# EAGLE design MUL-6S (EAGLE 9.5.2)
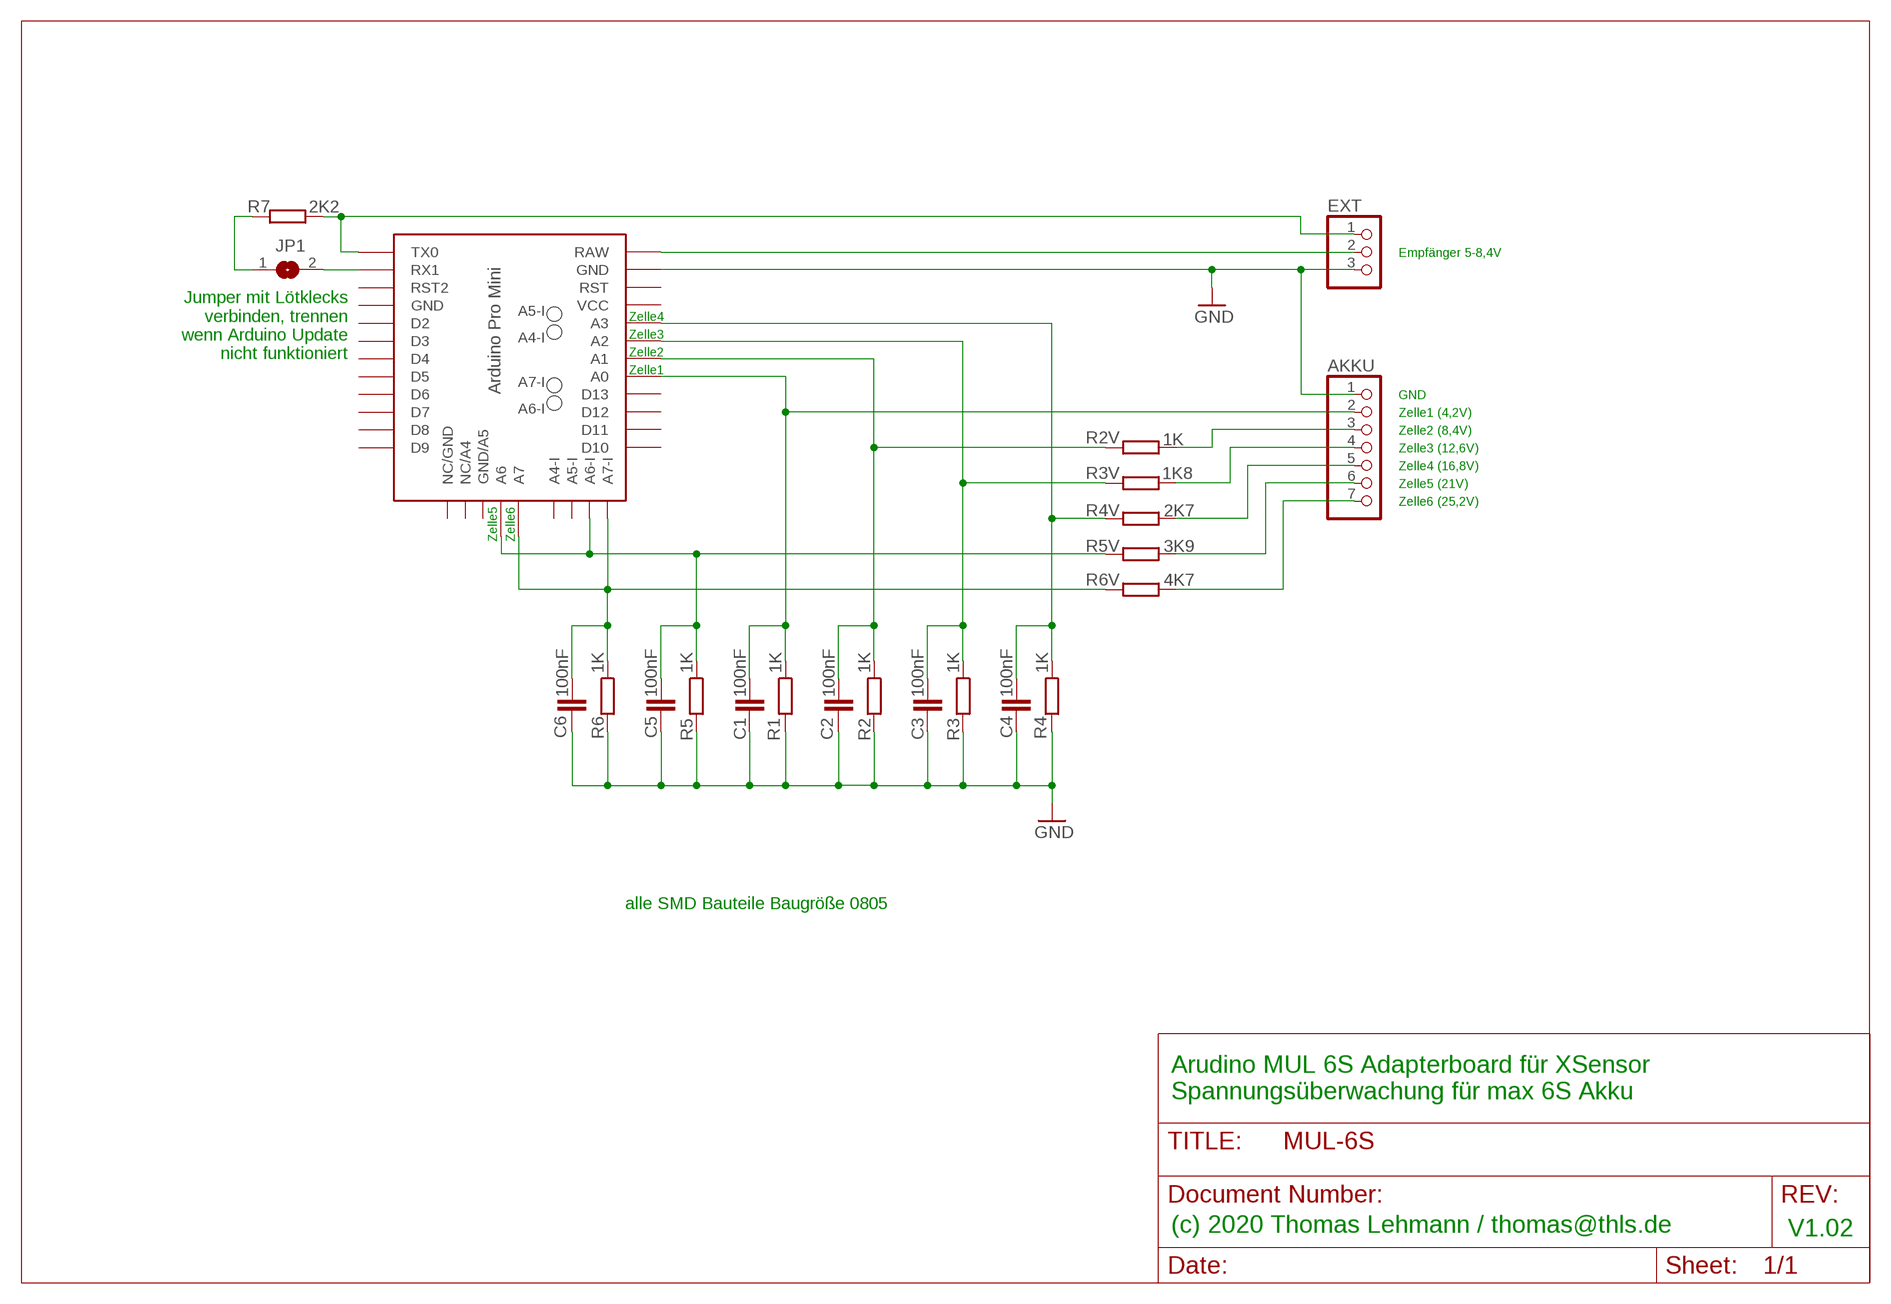
[diagram p0: schematic, sheet 1]

## Parts
AKKU  PINHD-1X7/90  [1X07/90]
C1  100nF  C-EUC0805K  [C0805K]
C2  100nF  C-EUC0805K  [C0805K]
C3  100nF  C-EUC0805K  [C0805K]
C4  100nF  C-EUC0805K  [C0805K]
C5  100nF  C-EUC0805K  [C0805K]
C6  100nF  C-EUC0805K  [C0805K]
EXT  PINHD-1X3-LS/90  [1X03/90]
JP1  SJ  [SJ]
R1  1K  R-EU_R0805  [R0805]
R2  1K  R-EU_R0805  [R0805]
R2V  1K  R-EU_R0805  [R0805]
R3  1K  R-EU_R0805  [R0805]
R3V  1K8  R-EU_R0805  [R0805]
R4  1K  R-EU_R0805  [R0805]
R4V  2K7  R-EU_R0805  [R0805]
R5  1K  R-EU_R0805  [R0805]
R5V  3K9  R-EU_R0805  [R0805]
R6  1K  R-EU_R0805  [R0805]
R6V  4K7  R-EU_R0805  [R0805]
R7  2K2  R-EU_R0805  [R0805]
U$1  PRO-MINI-5PIN-KLPAD  [PRO-MINI-5PIN-KLPAD]

## Nets
GND: AKKU.1 C1.2 C2.2 C3.2 C4.2 C5.2 C6.2 EXT.3 R1.2 R2.2 R3.2 R4.2 R5.2 R6.2 U$1.GND
N$1: C4.1 R4.1 R4V.1 U$1.A3
N$2: EXT.2 U$1.RAW
N$3: EXT.1 R7.2 U$1.TX0
N$4: JP1.1 R7.1
N$5: AKKU.3 R2V.2
N$6: AKKU.4 R3V.2
N$7: AKKU.5 R4V.2
N$8: AKKU.6 R5V.2
N$9: AKKU.7 R6V.2
N$10: AKKU.2 C1.1 R1.1 U$1.A0
N$11: C5.1 R5.1 R5V.1 U$1.A6 U$1.A6-I
N$12: C6.1 R6.1 R6V.1 U$1.A7 U$1.A7-I
N$13: JP1.2 U$1.RX1
N$19: C2.1 R2.1 R2V.1 U$1.A1
N$20: C3.1 R3.1 R3V.1 U$1.A2
Unconnected: U$1.A4-I U$1.A5-I U$1.D2 U$1.D3 U$1.D4 U$1.D5 U$1.D6 U$1.D7 U$1.D8 U$1.D9 U$1.D10 U$1.D11 U$1.D12 U$1.D13 U$1.GND/A5 U$1.NC/A4 U$1.NC/GND U$1.RST U$1.RST1(RST2) U$1.VCC

## Notes on the sheet
- Empfänger 5-8,4V
- Jumper mit Lötklecks
  verbinden, trennen
  wenn Arduino Update
  nicht funktioniert
- Zelle4
- Zelle3
- Zelle2
- Zelle1
- GND
- Zelle1 (4,2V)
- Zelle2 (8,4V)
- Zelle3 (12,6V)
- Zelle4 (16,8V)
- Zelle5 (21V)
- Zelle6 (25,2V)
- Zelle5 | Zelle6
- alle SMD Bauteile Baugröße 0805
- Arudino MUL 6S Adapterboard für XSensor
  Spannungsüberwachung für max 6S Akku
- V1.02
- (c) 2020 Thomas Lehmann / thomas@thls.de

## Power pins joined to a net without a drawn wire
GND: U$1.GND1(GND)

## Library data of the parts
AKKU = _OwnLib:PINHD-1X7: PIN HEADER Symbol auf Lötseite
C1-C6 = resistor:C-EU: CAPACITOR, European symbol
EXT = _OwnLib:PINHD-1X3-LS: PIN HEADER
JP1 = jumper:SJ: SMD solder JUMPER
R1 R2 R2V R3 R3V R4 R4V R5 R5V R6 R6V R7 = resistor:R-EU_: RESISTOR, European symbol
U$1 = _OwnLib:PRO-MINI-5PIN-KLPAD: unterstützt werden drei Varianten des Arudino Mini Pro Unterseite: 5-Pin Version ohne interne A4-A7 3-Pin Version mit internen A4+A5 0-Pin Version mit internen A4-A7 !! die 0-Pin Version hat eine gespiegelte obere Stiftleiste (FTDI Adapter) !!

## Board
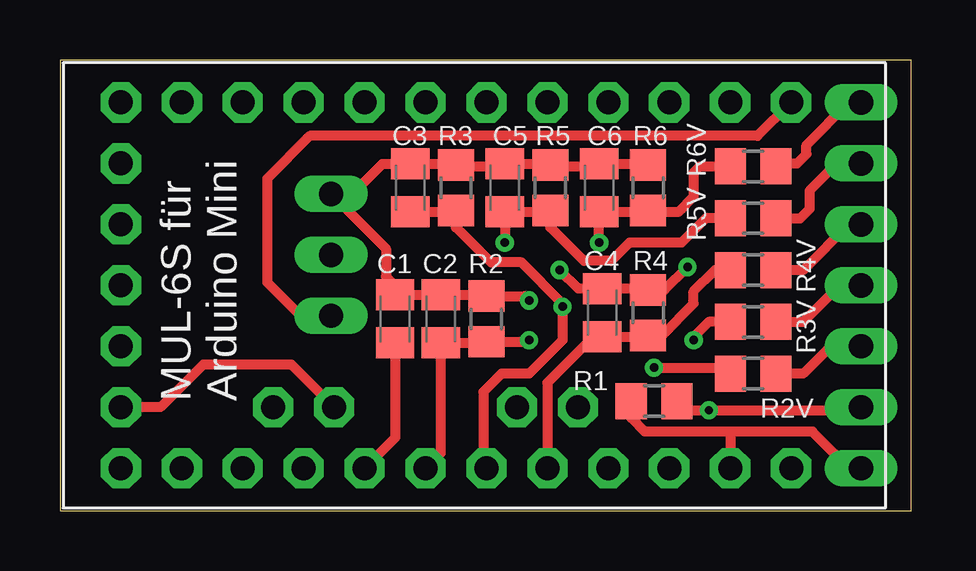
[diagram p1: board, top side]
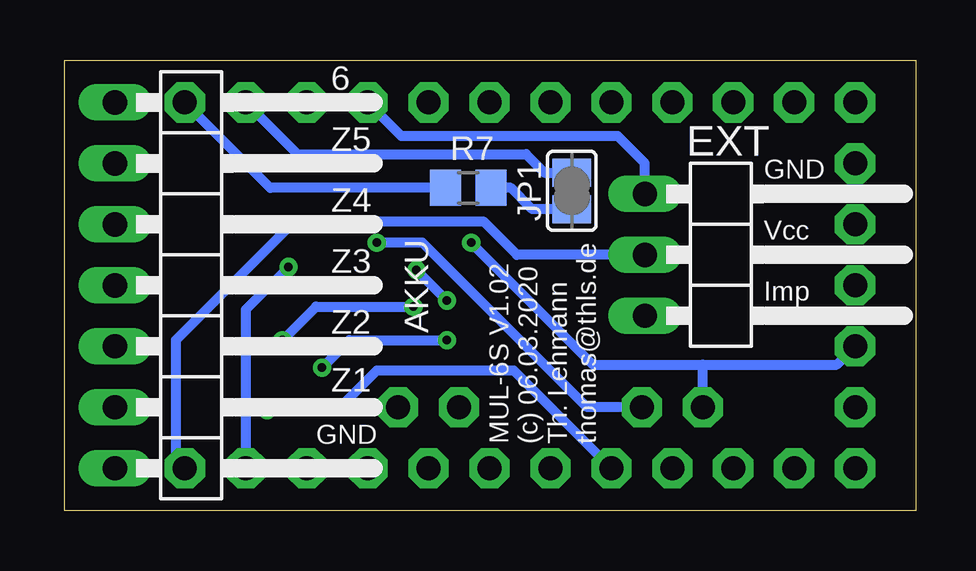
[diagram p2: board, bottom side, seen from below]

Size 35.48 x 18.79 mm. Coordinates in mm from the lower left corner, seen from the top.
Outline: 0,0 35.48,0 35.48,18.79 0,18.79 0,0
Copper layers (1*16): Top 0.035mm / dielectric 1.5mm / Bottom 0.035mm
Design rules "default *": minimum track width 6mil, minimum drill 0.35mm, track to track 6mil, track to pad 6mil, pad to pad 6mil, via to via 6mil, smd to smd 6mil, copper to edge 20mil, drill to drill 6mil, minimum pad ring 10mil, minimum via ring 8mil, stop-mask expansion 4mil, vias tented up to drill 0mil, thermal gap 10mil

### Footprints (pad centres in the part's own frame; a part is rotated, then mirrored left to right if it is on the bottom)
1X07/90 = drill 1.016 long: 1 -7.62,-3.81; 2 -5.08,-3.81; 3 -2.54,-3.81; 4 0,-3.81; 5 2.54,-3.81; 6 5.08,-3.81; 7 7.62,-3.81
C0805K = smd 1.3 x 1.6: 1 -1,0; 2 1,0
1X03/90 = drill 1.016 long: 1 -2.54,-3.81; 2 0,-3.81; 3 2.54,-3.81
SJ = smd 1.168 x 1.6: 1 -0.762,0; 2 0.762,0
R0805 = smd 1.3 x 1.5: 1 -0.95,0; 2 0.95,0
PRO-MINI-5PIN-KLPAD = drill 1 pad 1.676 octagon: A0 8.89,8.89; A1 8.89,11.43; A2 8.89,13.97; A3 8.89,16.51; A4-I 6.35,15.24; A5-I 6.35,17.78; A6 3.81,-1.27; A6-I 6.35,5.08; A7 6.35,-1.27; A7-I 6.35,7.62; D2 -6.35,16.51; D3 -6.35,13.97; D4 -6.35,11.43; D5 -6.35,8.89; D6 -6.35,6.35; D7 -6.35,3.81; D8 -6.35,1.27; D9 -6.35,-1.27; D10 8.89,-1.27; D11 8.89,1.27; D12 8.89,3.81; D13 8.89,6.35; GND 8.89,24.13; GND1 -6.35,19.05; GND/A5 1.27,-1.27; NC/A4 -1.27,-1.27; NC/GND -3.81,-1.27; RAW 8.89,26.67; RST 8.89,21.59; RST1 -6.35,21.59; RX1 -6.35,24.13; TX0 -6.35,26.67; VCC 8.89,19.05

### Placement (x,y rotation side)
AKKU  29.59,9.4 90 top
C1  13.97,8 90 top
C2  15.88,8 90 top
C3  14.6,13.46 90 top
C4  22.61,8.25 90 top
C5  18.54,13.46 90 top
C6  22.48,13.46 90 top
EXT  7.49,10.67 90 top
JP1  14.35,13.34 90 bottom
R1  24.77,4.57 180 top
R2  17.78,8 90 top
R2V  28.89,5.71 0 top
R3  16.51,13.46 90 top
R3V  28.89,7.87 0 top
R4  24.51,8.25 90 top
R4V  28.89,10.03 0 top
R5  20.45,13.46 90 top
R5V  28.89,12.19 0 top
R6  24.51,13.46 90 top
R6V  28.89,14.35 0 top
R7  18.67,13.46 180 bottom
U$1  3.81,10.67 270 top

### Tracks (layer width: path | path; a pad name or v marks a point on that pad's centre or on a via)
GND  (via drill 0.35)
  Top 0.406: v20.83,10.03 21.61,9.25 C4.2 24.46,9.25 R4.2 25.21,9.21 v26.16,10.16 | v19.56,8.76 19.37,8.95 R2.2 17.73,9 C2.2 15.82,8.95 15.77,9 C1.2 13.97,9.38 13.59,9.76 13.59,10.92 EXT.3 12.19,13.21 13.45,14.46 C3.2 16.46,14.46 R3.2 16.59,14.34 18.41,14.34 C5.2 20.4,14.46 R5.2 20.52,14.34 22.35,14.34 C6.2 24.46,14.46 R6.2 | 27.94,3.3 U$1.GND | AKKU.1 32.89,1.78 31.37,3.3 27.94,3.3 | R1.2 23.81,3.87 24.38,3.3 27.94,3.3
  Bottom 0.406: EXT.3 11.3,14.48 12.45,15.62 21.46,15.62 U$1.GND1 | v26.16,10.16 27.94,8.38 U$1.GND | v20.83,10.03 v19.56,8.76
N$1
  Top 0.406: R4V.1 27.3,10.03 26.42,9.14 26.42,8.64 25.09,7.31 R4.1 24.46,7.25 C4.1 22.24,7.25 20.32,5.33 U$1.A3
N$2
  Bottom 0.406: EXT.2 16.64,10.67 18.03,12.07 25.91,12.07 30.86,7.11 30.86,2.16 U$1.RAW
N$3
  Top 0.406: U$1.TX0 29.08,15.62 10.41,15.62 8.64,13.84 8.64,9.53 10.03,8.13 EXT.1
  Bottom 0.406: R7.2 26.92,13.46 U$1.TX0
N$4
  Bottom 0.406: JP1.1 16,12.57 16.89,13.46 R7.1
N$5
  Top 0.406: R2V.2 30.99,5.71 32.13,6.86 AKKU.3
N$6
  Top 0.406: R3V.2 30.99,7.87 32.51,9.4 AKKU.4
N$7
  Top 0.406: AKKU.5 32.89,11.94 30.99,10.03 R4V.2
N$8
  Top 0.406: R5V.2 30.86,12.19 31.24,12.57 31.24,13.34 32.38,14.48 AKKU.6
N$9
  Top 0.406: AKKU.7 32.89,17.02 31.12,15.24 31.12,14.86 30.73,14.48 29.97,14.48 R6V.2
N$10  (via drill 0.35)
  Top 0.406: C1.1 13.97,3.05 U$1.A0 | R1.1 25.78,4.57 26.16,4.19 v27.05,4.19 33.27,4.19 AKKU.2
  Bottom 0.406: U$1.A0 16.76,5.84 22.48,5.84 24.13,4.19 v27.05,4.19
N$11  (via drill 0.35)
  Top 0.406: R5V.1 26.92,12.19 25.91,11.18 23.75,11.18 22.99,10.41 21.84,10.41 20.45,11.81 R5.1 20.4,12.46 C5.1 v18.54,11.18
  Bottom 0.406: v18.54,11.18 13.46,6.1 8.89,6.1 | U$1.A6 3.3,6.1 8.89,6.1 | U$1.A6-I 8.89,6.1
N$12  (via drill 0.35)
  Top 0.406: U$1.A7-I 9.65,6.1 5.97,6.1 4.19,4.32 U$1.A7 | 24.46,12.46 24.48,12.45 25.78,12.45 26.42,13.08 26.42,14.1 26.67,14.35 R6V.1 | 24.46,12.46 C6.1 v22.48,11.18 | 24.46,12.46 R6.1
  Bottom 0.406: U$1.A7-I 13.72,4.32 20.57,11.18 v22.48,11.18
N$13
  Bottom 0.406: U$1.RX1 25.78,14.86 16.26,14.86 15.49,14.1 JP1.2
N$19  (via drill 0.35)
  Top 0.406: U$1.A1 15.88,2.41 C2.1 17.73,7 R2.1 19.5,7.05 v19.56,7.11 | v24.77,5.97 27.69,5.97 R2V.1
  Bottom 0.406: v24.77,5.97 23.62,7.11 v19.56,7.11
N$20  (via drill 0.35)
  Top 0.406: R3V.1 27.05,7.87 26.42,7.24 v26.42,7.11 | C3.1 16.46,12.46 R3.1 16.51,11.81 17.97,10.35 19.24,10.35 20.95,8.64 v20.95,8.51 20.95,7.11 19.56,5.71 18.41,5.71 17.65,4.95 17.65,1.91 U$1.A2
  Bottom 0.406: v26.42,7.11 25.02,8.51 v20.95,8.51

### Text on the board
tNames: MUL-6S für / Arduino Mini
bNames: 6 | Z5 | GND | Z4 | Vcc | Z3 | Imp | Z2 | Z1 | MUL-6S V1.02 / (c) 06.03.2020 / Th. Lehmann / thomas@thls.de | GND